# EAGLE design Swathi (EAGLE 6.5.0)
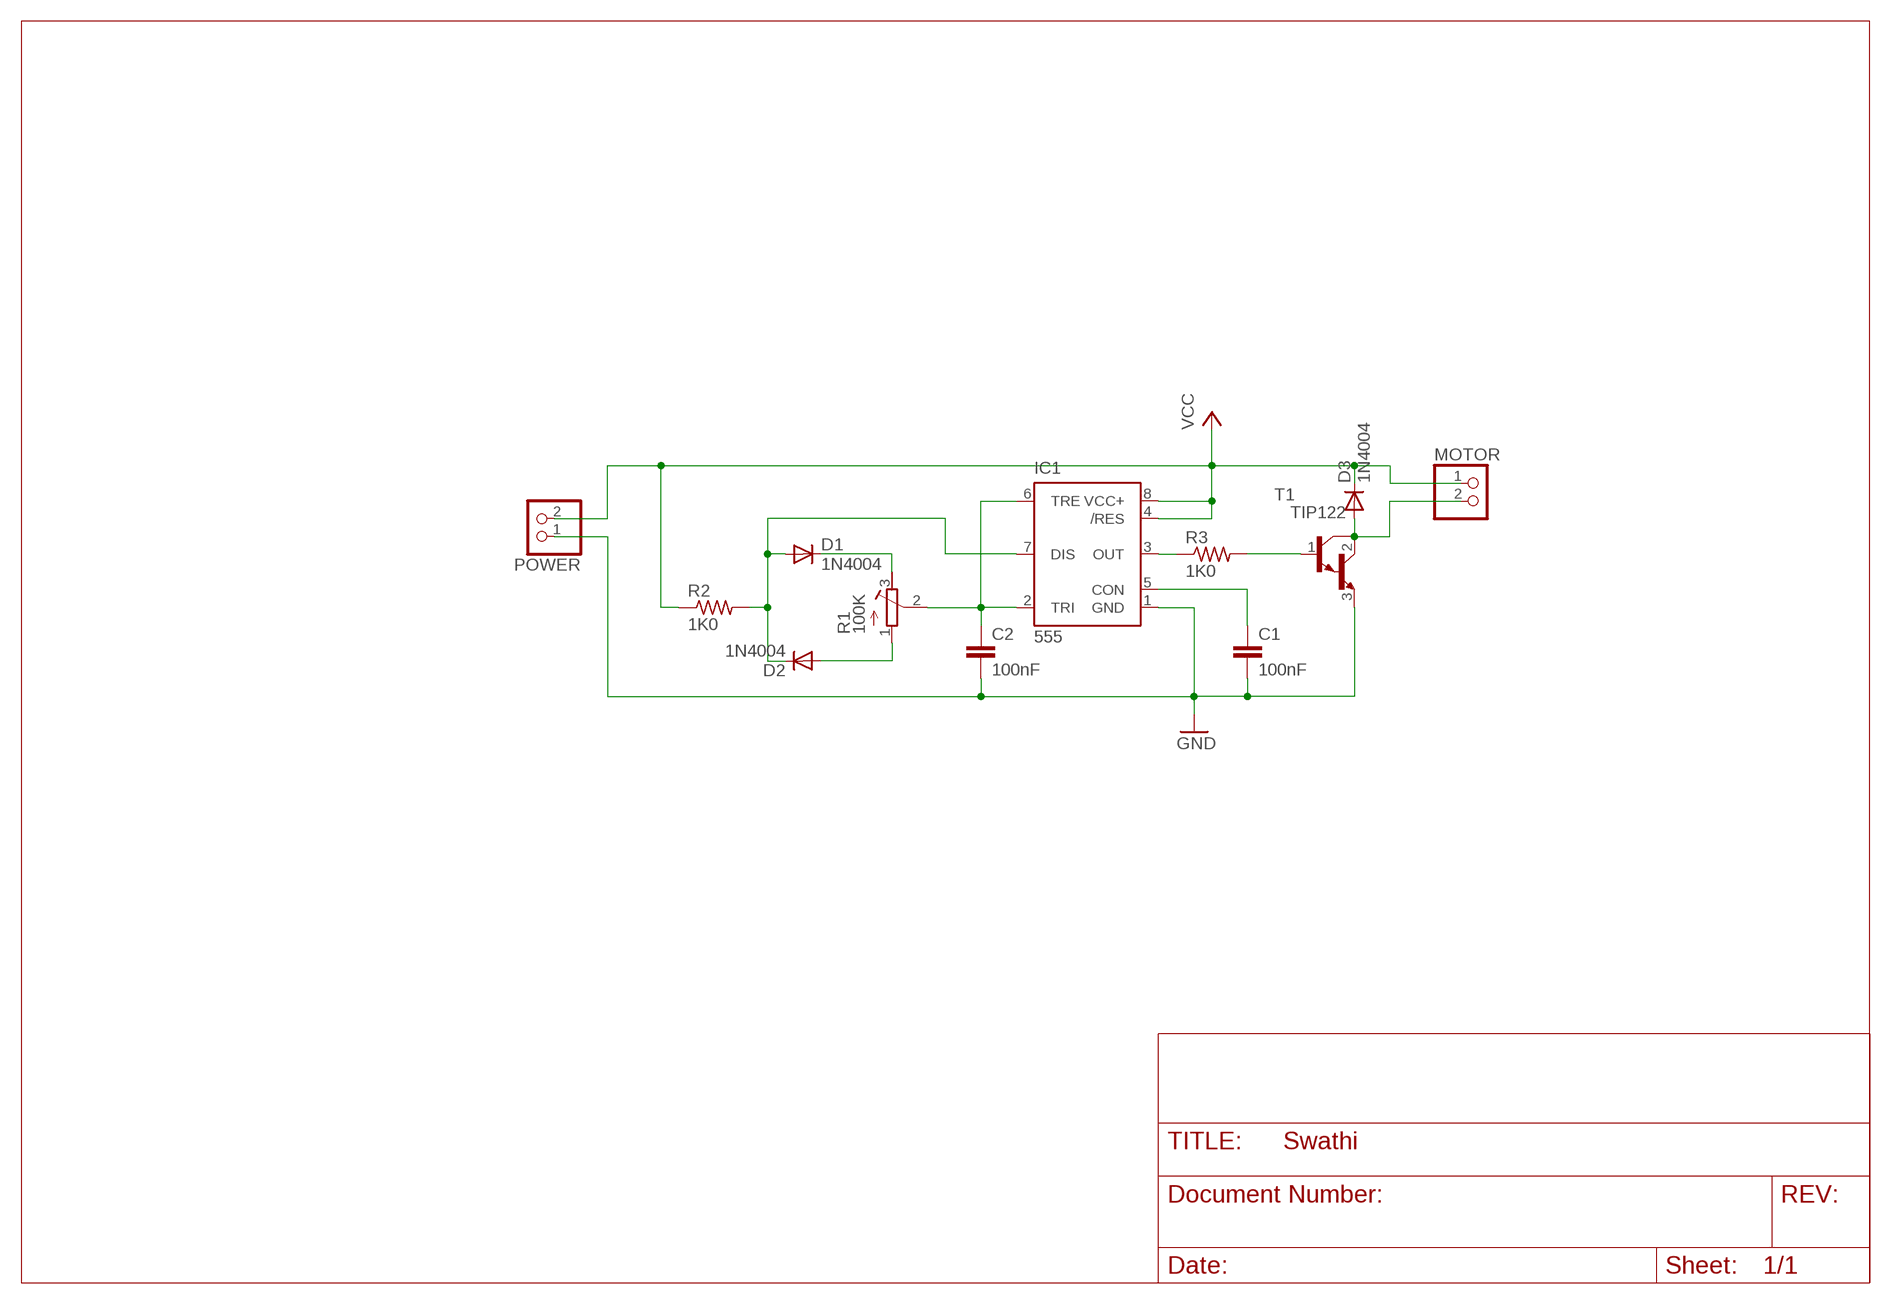
[diagram p0: schematic, sheet 1]

## Parts
C1  100nF  C-EU025-025X050  [C025-025X050]
C2  100nF  C-EU025-025X050  [C025-025X050]
D1  1N4004  [DO41-10]
D2  1N4004  [DO41-10]
D3  1N4004  [DO41-10]
IC1  555  555P  [DIP08]
MOTOR  PINHD-1X2  [1X02]
POWER  PINHD-1X2  [1X02]
R1  100K  R-TRIMM64W  [RTRIM64W]
R2  1K0  R-US_0204/7  [0204/7]
R3  1K0  R-US_0204/7  [0204/7]
T1  TIP122  [TO220]

## Nets
GND: C1.2 C2.2 IC1.1(GND) POWER.1 T1.3(E)
N$1: C2.1 IC1.2(TRI) IC1.6(TRE) R1.2(S)
N$3: C1.1 IC1.5(CON)
N$5: D1.C R1.3(E)
N$6: D2.A R1.1(A)
N$7: D1.A D2.C IC1.7(DIS) R2.2
N$10: IC1.3(OUT) R3.1
N$11: R3.2 T1.1(B)
N$13: D3.A MOTOR.2 T1.2(C)
VCC: D3.C IC1.4(/RES) IC1.8(VCC+) MOTOR.1 POWER.2 R2.1

## Library data of the parts
C1 C2 = rcl:C-EU: CAPACITOR, European symbol
D1-D3 = diode:1N4004: DIODE general purpose rectifier, 1 A
IC1 = SparkFun-IC-Special-Function:555: General purpose bipolar Timer Datasheet <http://www.sparkfun.com/datasheets/Components/General/ne555.pdf> SparkFun Products SparkFun SparkPunk Sequencer Kit <https://www.sparkfun.com/products/12707> (KIT-12707) Storefront Component: 555 Timer <https://www.sparkfun.com/products/9273> (COM-09273) Two parts valid for production: VFP: IC-11930 (M7555 PTH) VFP: IC-09173 (555 PTH) - Preferred; PROD_ID: IC-09173; PROD_ID_ALT: IC-09173
MOTOR POWER = pinhead01:PINHD-1X2: PIN HEADER
R1 = rcl:R-TRIMM: Trimm resistor
R2 R3 = rcl:R-US_: RESISTOR, American symbol
T1 = transistor:TIP122: NPN BIPOLAR DARLINGTON TRANSISTOR

## Board
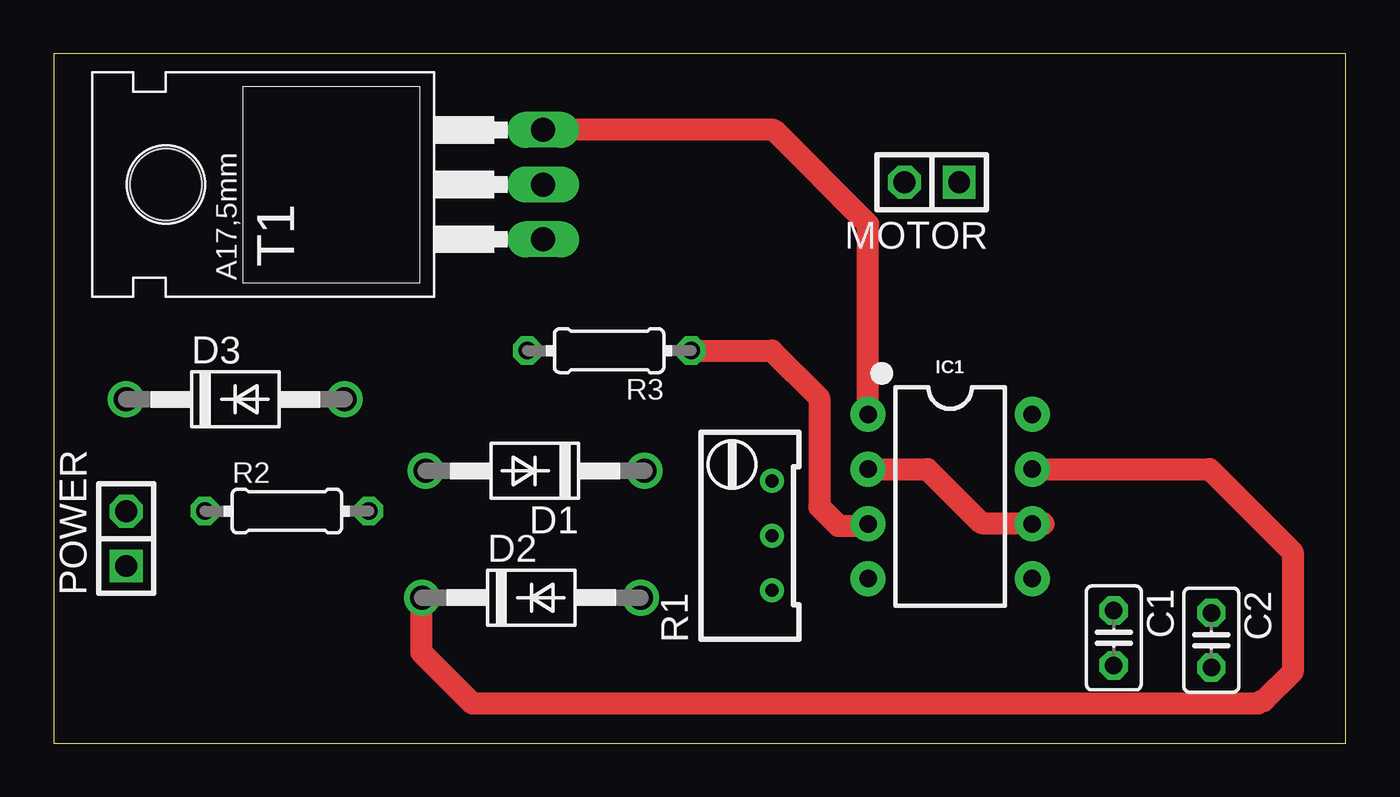
[diagram p1: board, top side]
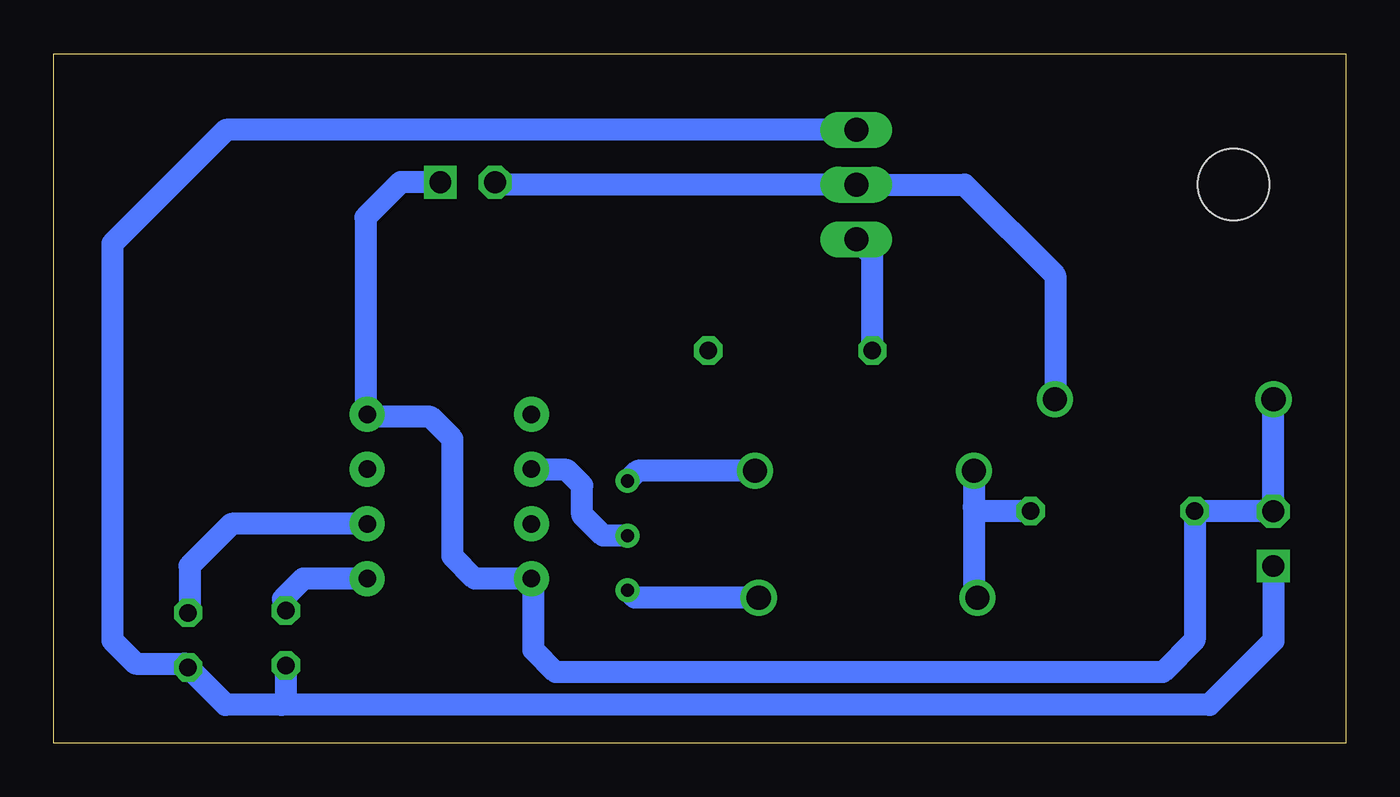
[diagram p2: board, bottom side, seen from below]

Size 60 x 32 mm. Coordinates in mm from the lower left corner, seen from the top.
Outline: 0,0 60,0 60,32 0,32 0,0
Copper layers (1*16): Top 0.035mm / dielectric 1.5mm / Bottom 0.035mm
Design rules "default": minimum track width 10mil, minimum drill 24mil, track to track 8mil, track to pad 8mil, pad to pad 8mil, via to via 8mil, smd to smd 8mil, copper to edge 40mil, drill to drill 8mil, minimum pad ring 10mil, minimum via ring 8mil, stop-mask expansion 4mil, vias tented up to drill 0mil, thermal gap 10mil

### Footprints (pad centres in the part's own frame; a part is rotated, then mirrored left to right if it is on the bottom)
C025-025X050 = drill 0.813 octagon: 1 -1.27,0; 2 1.27,0
DO41-10 = drill 1.118: A 5.08,0; C -5.08,0
DIP08 = drill 0.813 pad 1.626: 1 -3.81,-3.81; 2 -1.27,-3.81; 3 1.27,-3.81; 4 3.81,-3.81; 5 3.81,3.81; 6 1.27,3.81; 7 -1.27,3.81; 8 -3.81,3.81
1X02 = drill 1.016 square: 1 -1.27,0 | drill 1.016 octagon: 2 1.27,0
RTRIM64W = drill 0.61: 1 1.27,-2.54; 2 1.27,0; 3 1.27,2.54
0204/7 = drill 0.813 octagon: 1 -3.81,0; 2 3.81,0
TO220 = drill 1.118 long: 1 -2.54,-6.35; 2 0,-6.35; 3 2.54,-6.35 | hole 3.302: 0,11.176

### Placement (x,y rotation side)
C1  49.23,4.88 270 top
C2  53.76,4.78 270 top
D1  22.35,12.64 180 top
D2  22.18,6.75 0 top
D3  8.43,15.96 0 top
IC1  41.63,11.45 270 top
MOTOR  40.78,26.04 180 top
POWER  3.36,9.49 90 top
R1  32.08,9.63 0 top
R2  10.82,10.77 0 top
R3  25.79,18.22 180 top
T1  16.38,25.93 90 top

### Tracks (layer width: path | path; a pad name or v marks a point on that pad's centre or on a via)
GND
  Top 1.016: IC1.1 37.82,24.09 33.44,28.47 T1.3
  Bottom 1.016: POWER.1 3.36,4.74 6.33,1.77 49.42,1.77 | 49.42,1.77 52.02,1.77 C2.2 53.94,3.69 56.2,3.69 57.28,4.77 57.28,23.19 52,28.47 T1.3 | C1.2 49.23,1.96 49.42,1.77
N$1
  Top 1.016: IC1.2 40.58,12.72 43.09,10.21 45.94,10.21 45.97,10.18 IC1.6
  Bottom 1.016: R1.2 34.49,9.63 35.46,10.6 35.46,11.96 36.18,12.68 37.78,12.68 IC1.2 | IC1.6 51.75,10.18 53.7,8.23 53.7,6.11 C2.1
N$3
  Bottom 1.016: IC1.5 48.41,7.64 49.36,6.69 49.36,6.28 C1.1
N$5
  Bottom 1.016: D1.C 32.88,12.64 R1.3
N$6
  Bottom 1.016: D2.A 33.01,6.75 R1.1
N$7
  Top 1.016: IC1.7 53.69,12.72 57.54,8.87 57.54,3.3 56.2,1.96 56.07,1.96 55.94,1.83 19.44,1.83 17.07,4.2 17.07,6.72 D2.C
  Bottom 1.016: D1.A 17.27,10.96 | 17.27,10.96 17.27,6.92 D2.C | R2.2 17.08,10.77 17.27,10.96
N$10
  Top 1.016: R3.1 33.36,18.22 35.55,16.03 35.55,10.97 36.44,10.08 37.72,10.08 IC1.3
N$11
  Bottom 1.016: R3.2 21.98,22.64 T1.1
N$13
  Bottom 1.016: D3.A 13.49,15.98 13.49,21.72 17.7,25.93 T1.2 39.4,25.93 MOTOR.2
VCC
  Bottom 1.016: D3.C POWER.2 R2.1 7.01,4.79 8.5,3.3 36.69,3.3 37.72,4.33 37.72,7.54 IC1.4 40.45,7.64 41.49,8.68 41.49,14.12 42.51,15.14 45.32,15.14 IC1.8 45.52,15.34 45.52,24.41 43.89,26.04 MOTOR.1